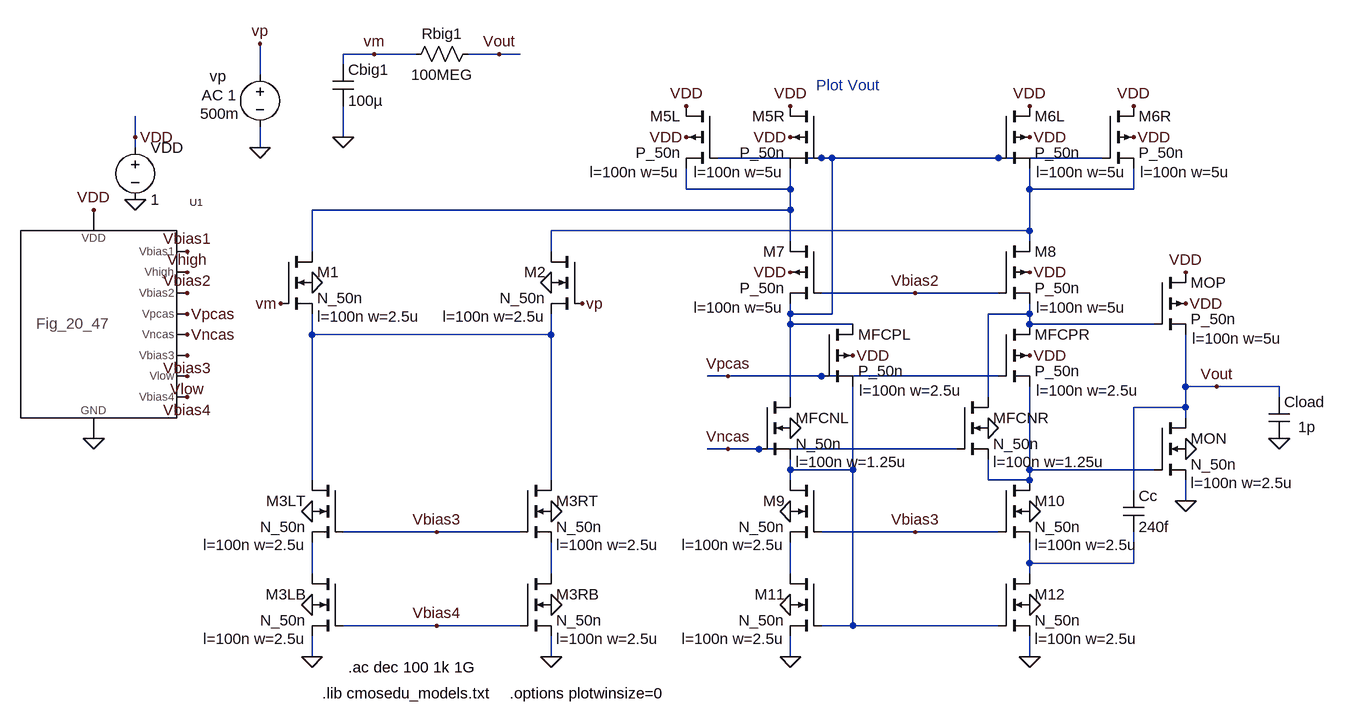
[diagram p0: schematic Fig24_45.asc]
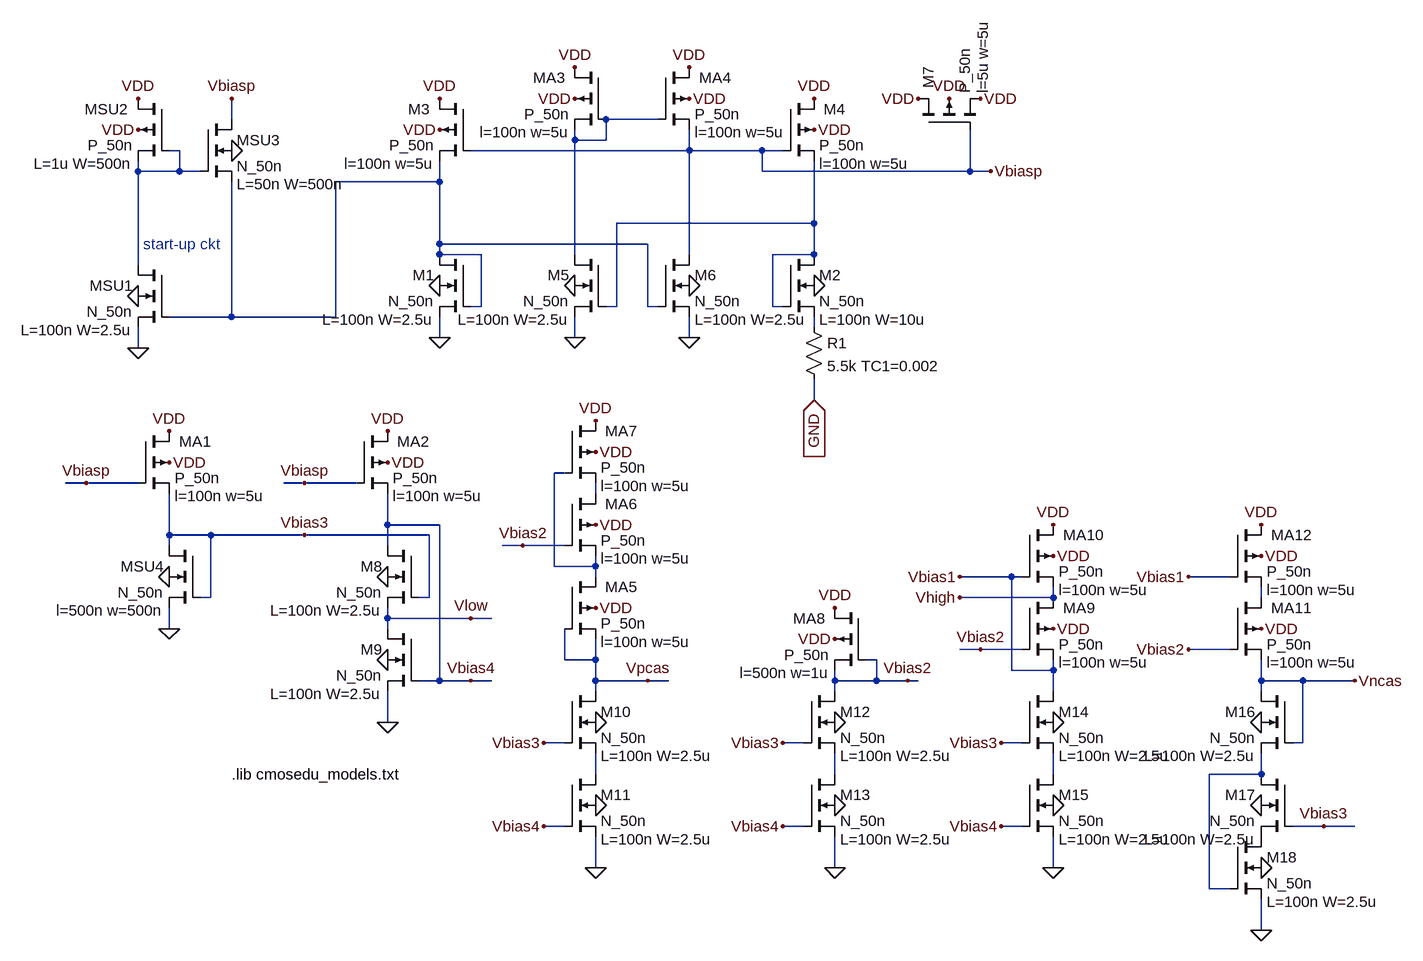
[diagram p1: sub-circuit fig_20_47.asc]
Fig24_45.asc, the LTspice schematic file:
Version 4
SHEET 1 3296 680
WIRE 1728 -1104 1680 -1104
WIRE 1792 -1104 1728 -1104
WIRE 1920 -1104 1872 -1104
WIRE 1952 -1104 1920 -1104
WIRE 1680 -1088 1680 -1104
WIRE 1552 -1072 1552 -1120
WIRE 1360 -976 1360 -1008
WIRE 1680 -976 1680 -1024
WIRE 1360 -960 1360 -976
WIRE 1552 -960 1552 -992
WIRE 2416 -944 2256 -944
WIRE 2432 -944 2416 -944
WIRE 2688 -944 2432 -944
WIRE 2848 -944 2688 -944
WIRE 2208 -896 2208 -928
WIRE 2368 -896 2368 -928
WIRE 2368 -896 2208 -896
WIRE 2736 -896 2736 -928
WIRE 2896 -896 2896 -928
WIRE 2896 -896 2736 -896
WIRE 2368 -864 2368 -896
WIRE 2368 -864 1632 -864
WIRE 2736 -832 2736 -896
WIRE 2736 -832 2000 -832
WIRE 2368 -816 2368 -864
WIRE 2736 -816 2736 -832
WIRE 1632 -800 1632 -864
WIRE 2000 -800 2000 -832
WIRE 2560 -736 2416 -736
WIRE 2688 -736 2560 -736
WIRE 2368 -704 2368 -720
WIRE 2432 -704 2432 -944
WIRE 2432 -704 2368 -704
WIRE 2736 -704 2736 -720
WIRE 2736 -704 2672 -704
WIRE 2368 -688 2368 -704
WIRE 2464 -688 2368 -688
WIRE 2736 -688 2736 -704
WIRE 2928 -688 2736 -688
WIRE 1632 -672 1632 -704
WIRE 2000 -672 2000 -704
WIRE 2000 -672 1632 -672
WIRE 2272 -608 2240 -608
WIRE 2416 -608 2272 -608
WIRE 2688 -608 2416 -608
WIRE 2976 -592 2976 -672
WIRE 3024 -592 2976 -592
WIRE 3120 -592 3024 -592
WIRE 2368 -576 2368 -688
WIRE 2672 -576 2672 -704
WIRE 3120 -576 3120 -592
WIRE 2976 -560 2976 -592
WIRE 2976 -560 2896 -560
WIRE 2976 -544 2976 -560
WIRE 2272 -496 2240 -496
WIRE 2320 -496 2272 -496
WIRE 2624 -496 2320 -496
WIRE 2368 -464 2368 -480
WIRE 2464 -464 2464 -592
WIRE 2464 -464 2368 -464
WIRE 2736 -464 2736 -592
WIRE 2928 -464 2736 -464
WIRE 1632 -448 1632 -672
WIRE 2000 -448 2000 -672
WIRE 2368 -448 2368 -464
WIRE 2672 -448 2672 -480
WIRE 2736 -448 2736 -464
WIRE 2736 -448 2672 -448
WIRE 2896 -432 2896 -560
WIRE 2976 -416 2976 -448
WIRE 1824 -368 1680 -368
WIRE 1952 -368 1824 -368
WIRE 2560 -368 2416 -368
WIRE 2688 -368 2560 -368
WIRE 2736 -320 2736 -352
WIRE 2896 -320 2896 -368
WIRE 2896 -320 2736 -320
WIRE 1632 -304 1632 -352
WIRE 2000 -304 2000 -352
WIRE 2368 -304 2368 -352
WIRE 2736 -304 2736 -320
WIRE 1824 -224 1680 -224
WIRE 1952 -224 1824 -224
WIRE 2464 -224 2464 -464
WIRE 2464 -224 2416 -224
WIRE 2688 -224 2464 -224
WIRE 1632 -176 1632 -208
WIRE 2000 -176 2000 -208
WIRE 2368 -176 2368 -208
WIRE 2736 -176 2736 -208
FLAG 1360 -880 0
FLAG 1360 -976 VDD
FLAG 1296 -864 VDD
FLAG 1296 -512 0
FLAG 1440 -800 Vbias1
FLAG 1440 -768 Vhigh
FLAG 1440 -736 Vbias2
FLAG 1440 -640 Vbias3
FLAG 1440 -704 Vpcas
FLAG 1440 -672 Vncas
FLAG 1440 -576 Vbias4
FLAG 1440 -608 Vlow
FLAG 2896 -976 VDD
FLAG 1632 -752 0
FLAG 2000 -752 0
FLAG 1584 -720 vm
FLAG 2048 -720 vp
FLAG 2000 -400 0
FLAG 2000 -256 0
FLAG 2000 -176 0
FLAG 1632 -400 0
FLAG 1632 -256 0
FLAG 1632 -176 0
FLAG 1824 -368 Vbias3
FLAG 1824 -224 Vbias4
FLAG 2736 -400 0
FLAG 2736 -256 0
FLAG 2736 -176 0
FLAG 2368 -400 0
FLAG 2368 -256 0
FLAG 2368 -176 0
FLAG 2560 -368 Vbias3
FLAG 2736 -976 VDD
FLAG 2736 -1024 VDD
FLAG 2896 -1024 VDD
FLAG 2208 -976 VDD
FLAG 2368 -976 VDD
FLAG 2368 -1024 VDD
FLAG 2208 -1024 VDD
FLAG 2736 -768 VDD
FLAG 2368 -768 VDD
FLAG 2560 -736 Vbias2
FLAG 3120 -512 0
FLAG 1552 -960 0
FLAG 1552 -1120 vp
FLAG 3024 -592 Vout
FLAG 2464 -640 VDD
FLAG 2736 -640 VDD
FLAG 2672 -528 0
FLAG 2368 -528 0
FLAG 2272 -608 Vpcas
FLAG 2272 -496 Vncas
FLAG 2976 -720 VDD
FLAG 2976 -768 VDD
FLAG 2976 -496 0
FLAG 2976 -416 0
FLAG 1680 -976 0
FLAG 1920 -1104 Vout
FLAG 1728 -1104 vm
SYMBOL voltage 1360 -976 R0
WINDOW 123 0 0 Left 0
WINDOW 39 0 0 Left 0
SYMATTR InstName VDD
SYMATTR Value 1
SYMBOL Fig_20_47 1296 -688 R0
SYMATTR InstName U1
SYMBOL pmos4 2848 -1024 R0
WINDOW 123 58 102 Left 0
WINDOW 0 56 16 Left 0
SYMATTR Value2 l=100n w=5u
SYMATTR InstName M6R
SYMATTR Value P_50n
SYMBOL nmos4 1584 -800 R0
WINDOW 123 56 100 Left 0
SYMATTR Value2 l=100n w=2.5u
SYMATTR InstName M1
SYMATTR Value N_50n
SYMBOL nmos4 2048 -800 M0
WINDOW 123 56 100 Left 0
SYMATTR Value2 l=100n w=2.5u
SYMATTR InstName M2
SYMATTR Value N_50n
SYMBOL nmos4 1952 -448 R0
WINDOW 123 56 100 Left 0
SYMATTR Value2 l=100n w=2.5u
SYMATTR InstName M3RT
SYMATTR Value N_50n
SYMBOL nmos4 1952 -304 R0
WINDOW 123 56 100 Left 0
SYMATTR Value2 l=100n w=2.5u
SYMATTR InstName M3RB
SYMATTR Value N_50n
SYMBOL nmos4 1680 -448 M0
WINDOW 123 56 100 Left 0
SYMATTR Value2 l=100n w=2.5u
SYMATTR InstName M3LT
SYMATTR Value N_50n
SYMBOL nmos4 1680 -304 M0
WINDOW 123 56 100 Left 0
SYMATTR Value2 l=100n w=2.5u
SYMATTR InstName M3LB
SYMATTR Value N_50n
SYMBOL nmos4 2688 -448 R0
WINDOW 123 56 100 Left 0
SYMATTR Value2 l=100n w=2.5u
SYMATTR InstName M10
SYMATTR Value N_50n
SYMBOL nmos4 2688 -304 R0
WINDOW 123 56 100 Left 0
SYMATTR Value2 l=100n w=2.5u
SYMATTR InstName M12
SYMATTR Value N_50n
SYMBOL nmos4 2416 -448 M0
WINDOW 123 56 100 Left 0
SYMATTR Value2 l=100n w=2.5u
SYMATTR InstName M9
SYMATTR Value N_50n
SYMBOL nmos4 2416 -304 M0
WINDOW 123 56 100 Left 0
SYMATTR Value2 l=100n w=2.5u
SYMATTR InstName M11
SYMATTR Value N_50n
SYMBOL pmos4 2688 -1024 R0
WINDOW 123 58 102 Left 0
WINDOW 0 56 16 Left 0
SYMATTR Value2 l=100n w=5u
SYMATTR InstName M6L
SYMATTR Value P_50n
SYMBOL pmos4 2256 -1024 M0
WINDOW 123 58 102 Left 0
WINDOW 0 56 16 Left 0
SYMATTR Value2 l=100n w=5u
SYMATTR InstName M5L
SYMATTR Value P_50n
SYMBOL pmos4 2416 -1024 M0
WINDOW 123 58 102 Left 0
WINDOW 0 56 16 Left 0
SYMATTR Value2 l=100n w=5u
SYMATTR InstName M5R
SYMATTR Value P_50n
SYMBOL pmos4 2688 -816 R0
WINDOW 123 58 102 Left 0
WINDOW 0 56 16 Left 0
SYMATTR Value2 l=100n w=5u
SYMATTR InstName M8
SYMATTR Value P_50n
SYMBOL pmos4 2416 -816 M0
WINDOW 123 58 102 Left 0
WINDOW 0 56 16 Left 0
SYMATTR Value2 l=100n w=5u
SYMATTR InstName M7
SYMATTR Value P_50n
SYMBOL cap 3104 -576 R0
WINDOW 3 45 46 Left 0
SYMATTR Value 1p
SYMATTR InstName Cload
SYMBOL voltage 1552 -1088 R0
WINDOW 0 -77 18 Left 0
WINDOW 3 -92 76 Left 0
WINDOW 123 -90 47 Left 0
WINDOW 39 0 0 Left 0
SYMATTR InstName vp
SYMATTR Value 500m
SYMATTR Value2 AC 1
SYMBOL pmos4 2416 -688 R0
WINDOW 123 58 102 Left 0
WINDOW 0 56 16 Left 0
SYMATTR Value2 l=100n w=2.5u
SYMATTR InstName MFCPL
SYMATTR Value P_50n
SYMBOL pmos4 2688 -688 R0
WINDOW 123 58 102 Left 0
WINDOW 0 56 16 Left 0
SYMATTR Value2 l=100n w=2.5u
SYMATTR InstName MFCPR
SYMATTR Value P_50n
SYMBOL nmos4 2624 -576 R0
WINDOW 123 56 100 Left 0
SYMATTR Value2 l=100n w=1.25u
SYMATTR InstName MFCNR
SYMATTR Value N_50n
SYMBOL nmos4 2320 -576 R0
WINDOW 123 56 100 Left 0
SYMATTR Value2 l=100n w=1.25u
SYMATTR InstName MFCNL
SYMATTR Value N_50n
SYMBOL pmos4 2928 -768 R0
WINDOW 123 58 102 Left 0
WINDOW 0 56 16 Left 0
SYMATTR Value2 l=100n w=5u
SYMATTR InstName MOP
SYMATTR Value P_50n
SYMBOL nmos4 2928 -544 R0
WINDOW 123 56 100 Left 0
SYMATTR Value2 l=100n w=2.5u
SYMATTR InstName MON
SYMATTR Value N_50n
SYMBOL cap 2880 -432 R0
SYMATTR InstName Cc
SYMATTR Value 240f
SYMBOL cap 1664 -1088 R0
SYMATTR InstName Cbig1
SYMATTR Value 100µ
SYMBOL res 1776 -1088 R270
WINDOW 0 32 56 VTop 0
WINDOW 3 0 56 VBottom 0
SYMATTR InstName Rbig1
SYMATTR Value 100MEG
TEXT 1648 -120 Left 0 !.lib cmosedu_models.txt
TEXT 2408 -1056 Left 0 ;Plot Vout
TEXT 1688 -160 Left 0 !.ac dec 100 1k 1G
TEXT 1936 -120 Left 0 !.options plotwinsize=0

fig_20_47.asc, the sub-circuit schematic file:
Version 4
SHEET 1 2508 1124
WIRE 464 416 432 416
WIRE 544 -64 544 -80
WIRE 544 80 544 -64
WIRE 544 208 544 176
WIRE 544 416 464 416
WIRE 592 496 592 432
WIRE 592 512 592 496
WIRE 592 640 592 608
WIRE 608 -96 592 -96
WIRE 608 -64 544 -64
WIRE 608 -64 608 -96
WIRE 640 -64 608 -64
WIRE 656 496 592 496
WIRE 656 592 640 592
WIRE 656 592 656 496
WIRE 688 -144 688 -176
WIRE 688 160 592 160
WIRE 688 160 688 -48
WIRE 800 416 768 416
WIRE 800 496 656 496
WIRE 848 160 688 160
WIRE 848 160 848 -48
WIRE 880 416 800 416
WIRE 928 480 928 432
WIRE 928 512 928 480
WIRE 928 624 928 608
WIRE 928 640 928 624
WIRE 928 784 928 736
WIRE 992 496 800 496
WIRE 992 592 976 592
WIRE 992 592 992 496
WIRE 1008 -48 848 -48
WIRE 1008 -48 1008 -80
WIRE 1008 48 1008 -48
WIRE 1008 64 1008 48
WIRE 1008 192 1008 160
WIRE 1008 480 928 480
WIRE 1008 720 976 720
WIRE 1008 720 1008 480
WIRE 1056 624 928 624
WIRE 1056 720 1008 720
WIRE 1072 64 1008 64
WIRE 1072 144 1056 144
WIRE 1072 144 1072 64
WIRE 1088 624 1056 624
WIRE 1088 720 1056 720
WIRE 1136 512 1104 512
WIRE 1184 544 1184 400
WIRE 1200 400 1184 400
WIRE 1200 512 1136 512
WIRE 1200 688 1200 640
WIRE 1200 816 1168 816
WIRE 1200 944 1168 944
WIRE 1216 -112 1216 -128
WIRE 1216 64 1216 -112
WIRE 1216 192 1216 160
WIRE 1248 432 1248 416
WIRE 1248 544 1184 544
WIRE 1248 544 1248 528
WIRE 1248 560 1248 544
WIRE 1248 688 1200 688
WIRE 1248 688 1248 656
WIRE 1248 720 1248 688
WIRE 1248 736 1248 720
WIRE 1248 864 1248 832
WIRE 1248 1008 1248 960
WIRE 1264 -112 1216 -112
WIRE 1264 -112 1264 -144
WIRE 1280 144 1264 144
WIRE 1280 144 1280 16
WIRE 1328 48 1008 48
WIRE 1328 144 1328 48
WIRE 1328 720 1248 720
WIRE 1344 -144 1264 -144
WIRE 1344 144 1328 144
WIRE 1360 720 1328 720
WIRE 1392 -96 1056 -96
WIRE 1392 -96 1392 -128
WIRE 1392 64 1392 -96
WIRE 1392 192 1392 160
WIRE 1504 -96 1392 -96
WIRE 1504 -64 1504 -96
WIRE 1520 144 1520 64
WIRE 1536 -96 1504 -96
WIRE 1536 144 1520 144
WIRE 1568 816 1536 816
WIRE 1568 944 1536 944
WIRE 1584 16 1280 16
WIRE 1584 16 1584 -80
WIRE 1584 64 1520 64
WIRE 1584 64 1584 16
WIRE 1584 176 1584 160
WIRE 1584 288 1584 256
WIRE 1616 720 1616 704
WIRE 1616 736 1616 720
WIRE 1616 864 1616 832
WIRE 1616 1008 1616 960
WIRE 1680 688 1664 688
WIRE 1680 720 1616 720
WIRE 1680 720 1680 688
WIRE 1728 720 1680 720
WIRE 1744 720 1728 720
WIRE 1824 -64 1504 -64
WIRE 1824 -64 1824 -128
WIRE 1840 672 1808 672
WIRE 1856 -64 1824 -64
WIRE 1888 560 1808 560
WIRE 1888 704 1888 560
WIRE 1904 560 1888 560
WIRE 1904 672 1840 672
WIRE 1904 816 1872 816
WIRE 1904 944 1872 944
WIRE 1952 592 1808 592
WIRE 1952 592 1952 576
WIRE 1952 704 1888 704
WIRE 1952 704 1952 688
WIRE 1952 736 1952 704
WIRE 1952 864 1952 832
WIRE 1952 1008 1952 960
WIRE 2192 1040 2192 864
WIRE 2224 560 2160 560
WIRE 2224 672 2160 672
WIRE 2224 1040 2192 1040
WIRE 2272 592 2272 576
WIRE 2272 720 2272 688
WIRE 2272 736 2272 720
WIRE 2272 864 2192 864
WIRE 2272 864 2272 832
WIRE 2272 880 2272 864
WIRE 2272 1104 2272 1056
WIRE 2336 720 2272 720
WIRE 2336 816 2320 816
WIRE 2336 816 2336 720
WIRE 2368 944 2320 944
WIRE 2416 720 2336 720
WIRE 2416 944 2368 944
FLAG 544 -128 VDD
FLAG 544 -176 VDD
FLAG 544 208 0
FLAG 544 128 0
FLAG 688 -96 0
FLAG 688 -176 Vbiasp
FLAG 1008 -128 VDD
FLAG 1008 -176 VDD
FLAG 1584 -128 VDD
FLAG 1584 -176 VDD
FLAG 1856 -64 Vbiasp
FLAG 1008 192 0
FLAG 1008 112 0
FLAG 1584 112 0
FLAG 1392 -176 VDD
FLAG 1392 -224 VDD
FLAG 1216 -176 VDD
FLAG 1216 -224 VDD
FLAG 1216 112 0
FLAG 1392 112 0
FLAG 1216 192 0
FLAG 1392 192 0
FLAG 1792 -176 VDD
FLAG 1744 -176 VDD
FLAG 1840 -176 VDD
FLAG 592 384 VDD
FLAG 592 336 VDD
FLAG 464 416 Vbiasp
FLAG 928 384 VDD
FLAG 928 336 VDD
FLAG 800 416 Vbiasp
FLAG 592 640 0
FLAG 592 560 0
FLAG 928 560 0
FLAG 928 688 0
FLAG 928 784 0
FLAG 800 496 Vbias3
FLAG 1248 784 0
FLAG 1248 912 0
FLAG 1248 1008 0
FLAG 1056 624 Vlow
FLAG 1056 720 Vbias4
FLAG 1168 816 Vbias3
FLAG 1168 944 Vbias4
FLAG 1616 784 0
FLAG 1616 912 0
FLAG 1616 1008 0
FLAG 1536 816 Vbias3
FLAG 1536 944 Vbias4
FLAG 1952 784 0
FLAG 1952 912 0
FLAG 1952 1008 0
FLAG 1872 816 Vbias3
FLAG 1872 944 Vbias4
FLAG 1248 608 VDD
FLAG 1328 720 Vpcas
FLAG 1248 480 VDD
FLAG 1248 368 VDD
FLAG 1248 320 VDD
FLAG 1136 512 Vbias2
FLAG 1616 656 VDD
FLAG 1616 608 VDD
FLAG 1728 720 Vbias2
FLAG 1952 640 VDD
FLAG 1952 528 VDD
FLAG 1952 480 VDD
FLAG 1840 672 Vbias2
FLAG 1808 560 Vbias1
FLAG 1808 592 Vhigh
FLAG 2272 640 VDD
FLAG 2272 528 VDD
FLAG 2272 480 VDD
FLAG 2160 560 Vbias1
FLAG 2160 672 Vbias2
FLAG 2272 784 0
FLAG 2272 912 0
FLAG 2272 1008 0
FLAG 2272 1104 0
FLAG 2416 720 Vncas
FLAG 2368 944 Vbias3
FLAG 1584 288 GND
IOPIN 1584 288 In
SYMBOL pmos4 592 -176 M0
WINDOW 0 63 16 Left 0
WINDOW 123 56 100 Left 0
SYMATTR InstName MSU2
SYMATTR Value2 L=1u W=500n
SYMATTR Value P_50n
SYMBOL nmos4 592 80 M0
WINDOW 123 56 100 Left 0
SYMATTR Value2 L=100n W=2.5u
SYMATTR InstName MSU1
SYMATTR Value N_50n
SYMBOL nmos4 640 -144 R0
WINDOW 123 56 100 Left 0
SYMATTR Value2 L=50n W=500n
SYMATTR InstName MSU3
SYMATTR Value N_50n
SYMBOL pmos4 1056 -176 M0
WINDOW 0 63 16 Left 0
WINDOW 123 56 100 Left 0
SYMATTR InstName M3
SYMATTR Value2 l=100n w=5u
SYMATTR Value P_50n
SYMBOL pmos4 1536 -176 R0
WINDOW 0 63 16 Left 0
WINDOW 123 56 100 Left 0
SYMATTR InstName M4
SYMATTR Value2 l=100n w=5u
SYMATTR Value P_50n
SYMBOL nmos4 1056 64 M0
WINDOW 123 56 100 Left 0
SYMATTR Value2 L=100n W=2.5u
SYMATTR InstName M1
SYMATTR Value N_50n
SYMBOL nmos4 1536 64 R0
WINDOW 123 56 100 Left 0
SYMATTR Value2 L=100n W=10u
SYMATTR InstName M2
SYMATTR Value N_50n
SYMBOL res 1568 160 R0
SYMATTR InstName R1
SYMATTR Value 5.5k TC1=0.002
SYMBOL pmos4 1344 -224 R0
WINDOW 0 63 16 Left 0
WINDOW 123 56 100 Left 0
SYMATTR InstName MA4
SYMATTR Value2 l=100n w=5u
SYMATTR Value P_50n
SYMBOL pmos4 1264 -224 M0
WINDOW 0 63 16 Left 0
WINDOW 123 56 100 Left 0
SYMATTR InstName MA3
SYMATTR Value2 l=100n w=5u
SYMATTR Value P_50n
SYMBOL nmos4 1264 64 M0
WINDOW 123 56 100 Left 0
SYMATTR Value2 L=100n W=2.5u
SYMATTR InstName M5
SYMATTR Value N_50n
SYMBOL nmos4 1344 64 R0
WINDOW 123 56 100 Left 0
SYMATTR Value2 L=100n W=2.5u
SYMATTR InstName M6
SYMATTR Value N_50n
SYMBOL pmos4 1744 -128 R270
WINDOW 0 63 16 Left 0
WINDOW 123 56 100 Left 0
SYMATTR InstName M7
SYMATTR Value2 l=5u w=5u
SYMATTR Value P_50n
SYMBOL pmos4 544 336 R0
WINDOW 0 63 16 Left 0
WINDOW 123 56 100 Left 0
SYMATTR InstName MA1
SYMATTR Value2 l=100n w=5u
SYMATTR Value P_50n
SYMBOL pmos4 880 336 R0
WINDOW 0 63 16 Left 0
WINDOW 123 56 100 Left 0
SYMATTR InstName MA2
SYMATTR Value2 l=100n w=5u
SYMATTR Value P_50n
SYMBOL nmos4 640 512 M0
WINDOW 123 56 100 Left 0
SYMATTR Value2 l=500n w=500n
SYMATTR InstName MSU4
SYMATTR Value N_50n
SYMBOL nmos4 976 512 M0
WINDOW 123 56 100 Left 0
SYMATTR Value2 L=100n W=2.5u
SYMATTR InstName M8
SYMATTR Value N_50n
SYMBOL nmos4 976 640 M0
WINDOW 123 56 100 Left 0
SYMATTR Value2 L=100n W=2.5u
SYMATTR InstName M9
SYMATTR Value N_50n
SYMBOL nmos4 1200 736 R0
WINDOW 123 56 100 Left 0
SYMATTR Value2 L=100n W=2.5u
SYMATTR InstName M10
SYMATTR Value N_50n
SYMBOL nmos4 1200 864 R0
WINDOW 123 56 100 Left 0
SYMATTR Value2 L=100n W=2.5u
SYMATTR InstName M11
SYMATTR Value N_50n
SYMBOL nmos4 1568 736 R0
WINDOW 123 56 100 Left 0
SYMATTR Value2 L=100n W=2.5u
SYMATTR InstName M12
SYMATTR Value N_50n
SYMBOL nmos4 1568 864 R0
WINDOW 123 56 100 Left 0
SYMATTR Value2 L=100n W=2.5u
SYMATTR InstName M13
SYMATTR Value N_50n
SYMBOL nmos4 1904 736 R0
WINDOW 123 56 100 Left 0
SYMATTR Value2 L=100n W=2.5u
SYMATTR InstName M14
SYMATTR Value N_50n
SYMBOL nmos4 1904 864 R0
WINDOW 123 56 100 Left 0
SYMATTR Value2 L=100n W=2.5u
SYMATTR InstName M15
SYMATTR Value N_50n
SYMBOL pmos4 1200 560 R0
WINDOW 0 63 16 Left 0
WINDOW 123 56 100 Left 0
SYMATTR InstName MA5
SYMATTR Value2 l=100n w=5u
SYMATTR Value P_50n
SYMBOL pmos4 1200 432 R0
WINDOW 0 63 16 Left 0
WINDOW 123 56 100 Left 0
SYMATTR InstName MA6
SYMATTR Value2 l=100n w=5u
SYMATTR Value P_50n
SYMBOL pmos4 1200 320 R0
WINDOW 0 63 16 Left 0
WINDOW 123 56 100 Left 0
SYMATTR InstName MA7
SYMATTR Value2 l=100n w=5u
SYMATTR Value P_50n
SYMBOL pmos4 1664 608 M0
WINDOW 0 63 16 Left 0
WINDOW 123 56 100 Left 0
SYMATTR InstName MA8
SYMATTR Value2 l=500n w=1u
SYMATTR Value P_50n
SYMBOL pmos4 1904 592 R0
WINDOW 0 63 16 Left 0
WINDOW 123 56 100 Left 0
SYMATTR InstName MA9
SYMATTR Value2 l=100n w=5u
SYMATTR Value P_50n
SYMBOL pmos4 1904 480 R0
WINDOW 0 63 16 Left 0
WINDOW 123 56 100 Left 0
SYMATTR InstName MA10
SYMATTR Value2 l=100n w=5u
SYMATTR Value P_50n
SYMBOL pmos4 2224 592 R0
WINDOW 0 63 16 Left 0
WINDOW 123 56 100 Left 0
SYMATTR InstName MA11
SYMATTR Value2 l=100n w=5u
SYMATTR Value P_50n
SYMBOL pmos4 2224 480 R0
WINDOW 0 63 16 Left 0
WINDOW 123 56 100 Left 0
SYMATTR InstName MA12
SYMATTR Value2 l=100n w=5u
SYMATTR Value P_50n
SYMBOL nmos4 2320 736 M0
WINDOW 123 56 100 Left 0
SYMATTR Value2 L=100n W=2.5u
SYMATTR InstName M16
SYMATTR Value N_50n
SYMBOL nmos4 2320 864 M0
WINDOW 123 56 100 Left 0
SYMATTR Value2 L=100n W=2.5u
SYMATTR InstName M17
SYMATTR Value N_50n
SYMBOL nmos4 2224 960 R0
WINDOW 123 56 100 Left 0
SYMATTR Value2 L=100n W=2.5u
SYMATTR InstName M18
SYMATTR Value N_50n
TEXT 552 48 Left 0 ;start-up ckt
TEXT 688 864 Left 0 !.lib cmosedu_models.txt

The netlist it stands for:
* Fig24_45.asc
VDD VDD 0 1
XU1 Vbias1 Vhigh Vbias2 Vpcas Vncas Vbias3 Vlow Vbias4 VDD 0 fig_20_47
M6R VDD N001 N003 VDD P_50n l=100n w=5u
M1 N002 vm N005 0 N_50n l=100n w=2.5u
M2 N003 vp N005 0 N_50n l=100n w=2.5u
M3RT N005 Vbias3 N010 0 N_50n l=100n w=2.5u
M3RB N010 Vbias4 0 0 N_50n l=100n w=2.5u
M3LT N005 Vbias3 N009 0 N_50n l=100n w=2.5u
M3LB N009 Vbias4 0 0 N_50n l=100n w=2.5u
M10 N007 Vbias3 N008 0 N_50n l=100n w=2.5u
M12 N008 N006 0 0 N_50n l=100n w=2.5u
M9 N006 Vbias3 N011 0 N_50n l=100n w=2.5u
M11 N011 N006 0 0 N_50n l=100n w=2.5u
M6L VDD N001 N003 VDD P_50n l=100n w=5u
M5L VDD N001 N002 VDD P_50n l=100n w=5u
M5R VDD N001 N002 VDD P_50n l=100n w=5u
M8 N003 Vbias2 N004 VDD P_50n l=100n w=5u
M7 N002 Vbias2 N001 VDD P_50n l=100n w=5u
Cload Vout 0 1p
vp vp 0 500m AC 1
MFCPL N001 Vpcas N006 VDD P_50n l=100n w=2.5u
MFCPR N004 Vpcas N007 VDD P_50n l=100n w=2.5u
MFCNR N004 Vncas N007 0 N_50n l=100n w=1.25u
MFCNL N001 Vncas N006 0 N_50n l=100n w=1.25u
MOP VDD N004 Vout VDD P_50n l=100n w=5u
MON Vout N007 0 0 N_50n l=100n w=2.5u
Cc Vout N008 240f
Cbig1 vm 0 100µ
Rbig1 vm Vout 100MEG

* block symbol definitions
.subckt fig_20_47 Vbias1 Vhigh Vbias2 Vpcas Vncas Vbias3 Vlow Vbias4 VDD GND
MSU2 VDD N001 N001 VDD P_50n L=1u W=500n
MSU1 N001 N002 0 0 N_50n L=100n W=2.5u
MSU3 Vbiasp N001 N002 0 N_50n L=50n W=500n
M3 VDD Vbiasp N002 VDD P_50n l=100n w=5u
M4 VDD Vbiasp N007 VDD P_50n l=100n w=5u
M1 N002 N002 0 0 N_50n L=100n W=2.5u
M2 N007 N007 N008 0 N_50n L=100n W=10u
R1 N008 GND 5.5k TC1=0.002
MA4 VDD N004 Vbiasp VDD P_50n l=100n w=5u
MA3 VDD N004 N004 VDD P_50n l=100n w=5u
M5 N004 N007 0 0 N_50n L=100n W=2.5u
M6 Vbiasp N002 0 0 N_50n L=100n W=2.5u
M7 VDD Vbiasp VDD VDD P_50n l=5u w=5u
MA1 VDD Vbiasp Vbias3 VDD P_50n l=100n w=5u
MA2 VDD Vbiasp Vbias4 VDD P_50n l=100n w=5u
MSU4 Vbias3 Vbias3 0 0 N_50n l=500n w=500n
M8 Vbias4 Vbias3 Vlow 0 N_50n L=100n W=2.5u
M9 Vlow Vbias4 0 0 N_50n L=100n W=2.5u
M10 Vpcas Vbias3 N006 0 N_50n L=100n W=2.5u
M11 N006 Vbias4 0 0 N_50n L=100n W=2.5u
M12 Vbias2 Vbias3 N009 0 N_50n L=100n W=2.5u
M13 N009 Vbias4 0 0 N_50n L=100n W=2.5u
M14 Vbias1 Vbias3 N010 0 N_50n L=100n W=2.5u
M15 N010 Vbias4 0 0 N_50n L=100n W=2.5u
MA5 N003 Vpcas Vpcas VDD P_50n l=100n w=5u
MA6 N005 Vbias2 N003 VDD P_50n l=100n w=5u
MA7 VDD N003 N005 VDD P_50n l=100n w=5u
MA8 VDD Vbias2 Vbias2 VDD P_50n l=500n w=1u
MA9 Vhigh Vbias2 Vbias1 VDD P_50n l=100n w=5u
MA10 VDD Vbias1 Vhigh VDD P_50n l=100n w=5u
MA11 N012 Vbias2 Vncas VDD P_50n l=100n w=5u
MA12 VDD Vbias1 N012 VDD P_50n l=100n w=5u
M16 Vncas Vncas N011 0 N_50n L=100n W=2.5u
M17 N011 Vbias3 P001 0 N_50n L=100n W=2.5u
M18 P001 N011 0 0 N_50n L=100n W=2.5u
* start-up ckt
.lib cmosedu_models.txt
.ends fig_20_47

.model NMOS NMOS
.model PMOS PMOS
.lib standard.mos
.lib cmosedu_models.txt
* Plot Vout
.ac dec 100 1k 1G
.options plotwinsize=0
.backanno
.end